# Altium schematic sheet VCC33.SchDoc
size A4; SheetNumber: 4; SheetTotal: 8
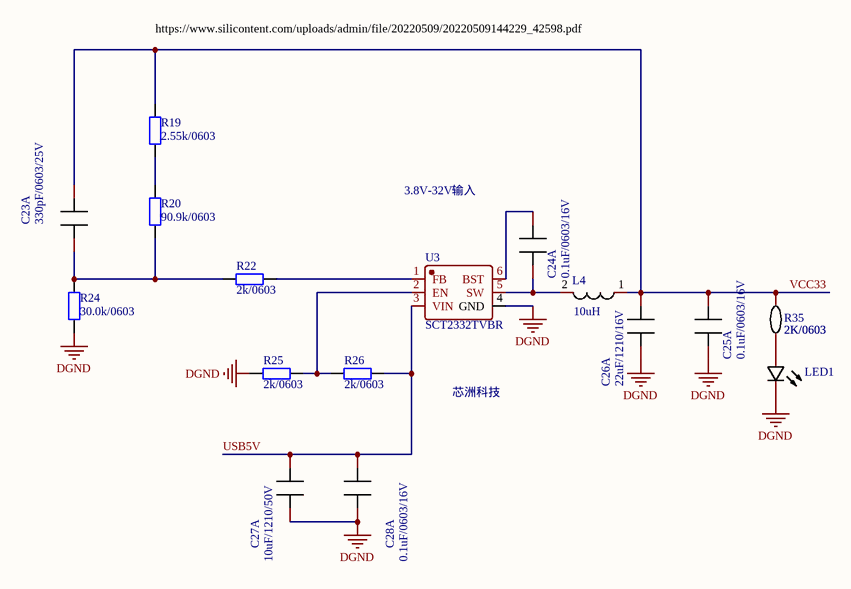
[diagram p0: VCC33.SchDoc]

## Parts
C23  330pF/0603/25V  [CAP0603]  (part A of 4)
C24  0.1uF/0603/16V  [CAP0603]  (part A of 4)
C25  0.1uF/0603/16V  [CAP0603]  (part A of 4)
C26  22uF/1210/16V  [CAP1210-CAPC3225X140N]  (part A of 4)
C27  10uF/1210/50V  [CAP1210-CAPC3225X140N]  (part A of 4)
C28  0.1uF/0603/16V  [CAP0603]  (part A of 4)
L4  10uH  [IND-SMD_L4.7-W4.7-6.5uH]
LED1  19-217/GHC-YR1S2/3T  [LED_0603_KA]  (value not drawn)
R19  2.55k/0603  [RES0603]
R20  90.9k/0603  [RES0603]
R22  2k/0603  [RES0603]
R24  30.0k/0603  [RES0603]
R25  2k/0603  [RES0603]
R26  2k/0603  [RES0603]
R35  2K/0603  [RES0603]
U3  SCT2332TVBR  [SCT2332TVBR-TSOT23-6]

## Nets
DGND: C25.2 C26.2 C27.2 C28.2 LED1.2(C) R24.1 R25.2 U3.4(GND)
USB5V: C27.1 C28.1 R26.1 U3.3(VIN)
VCC33: C23.1 C25.1 C26.1 L4.1 R19.2 R35.1
NetC23_2: C23.2 R20.1 R22.2 R24.2
NetC24_1: C24.1 U3.6(BST)
NetC24_2: C24.2 L4.2 U3.5(SW)
NetLED1_1: LED1.1(A) R35.2
NetR19_1: R19.1 R20.2
NetR22_1: R22.1 U3.1(FB)
NetR25_1: R25.1 R26.2 U3.2(EN)

## Notes on the sheet
- https://www.silicontent.com/uploads/admin/file/20220509/20220509144229_42598.pdf
- 3.8V-32V输入
- 芯洲科技

## Library data of the parts
C23 = CAP0603: SURFACE MOUNT CAPACITOR 0.031 X 0.061 INCHES; Manufacturer #1: IPC SM-782 STD.; Sim_Analog_Order: Model$; PCB DECAL: 0603; Add into BOM: yes; Name: CAP0603; Symbol: CAP0603; Device: CAP0603; OldName: CAP0603; Value: 330pF/0603/25V; Convert to PCB: yes; Origin Footprint: 0603
C24 C25 C28 = CAP0603: SURFACE MOUNT CAPACITOR 0.031 X 0.061 INCHES; Manufacturer #1: IPC SM-782 STD.; Sim_Analog_Order: Model$; Value: 0.1uF/0603/50V; PCB DECAL: 0603; Add into BOM: yes; Name: CAP0603; Symbol: CAP0603; Device: CAP0603; OldName: CAP0603; Convert to PCB: yes; Origin Footprint: 0603
C26 = CAP0603: SURFACE MOUNT CAPACITOR 0.031 X 0.061 INCHES; Manufacturer #1: IPC SM-782 STD.; Sim_Analog_Order: Model$; Value: 22uF/1210/35V; PCB DECAL: 0603; Add into BOM: yes; Name: CAP0603; Symbol: CAP0603; Device: CAP0603; OldName: CAP0603; Convert to PCB: yes; Origin Footprint: 0603
C27 = CAP0603: SURFACE MOUNT CAPACITOR 0.031 X 0.061 INCHES; Manufacturer #1: IPC SM-782 STD.; Sim_Analog_Order: Model$; Value: 10uF/1210/35V; PCB DECAL: 0603; Add into BOM: yes; Name: CAP0603; Symbol: CAP0603; Device: CAP0603; OldName: CAP0603; Convert to PCB: yes; Origin Footprint: 0603
L4 = IND-MOLDED: Sim_Analog_Order: Model$; Sim_Analog_Prefix: L; Description" MOLDED INDUCTOR, 0_5: PIN SPACING; PCB DECAL: L_0650; Add into BOM: yes; Name: IND-MOLDED; Symbol: IND-MOLDED; Device: IND-MOLDED; OldName: IND-MOLDED; Value: 10uH; Convert to PCB: yes; Origin Footprint: L_0650
LED1 = 19-217/GHC-YR1S2/3T: Manufacturer: EVERLIGHT; Convert to PCB: yes; Origin Footprint: LED0603-R-RD; Name: 19-217/GHC-YR1S2/3T; Symbol: 19-217/GHC-YR1S2/3T; Device: 19-217/GHC-YR1S2/3T; Supplier: LCSC; Manufacturer Part: 19-217/GHC-YR1S2/3T; Supplier Part: C72043; JLCPCB Part Class: Basic Part; Add into BOM: yes
R19 R20 R22 R24-R26 = Res2: Resistor; Published: 8-Jun-2000; LatestRevisionDate: 17-Jul-2002; LatestRevisionNote: Re-released for DXP Platform.; PackageReference: AXIAL-0.4; Publisher: Altium Limited; PackageDescription: Axial Device, Thru-Hole; 2 Leads; 0.4 in Pin Spacing
R35 = 2.2K: Manufacturer: UniOhm; Manufacturer Part: 0402WGF2201TCE; Convert to PCB: yes; Origin Footprint: R0402; Name: 2K/0603; Symbol: 2.2K; Device: 2.2K; Supplier: LCSC; Supplier Part: C25879; JLCPCB Part Class: Basic Part; Add into BOM: yes
U3 = SCT2332TVBR: 3.8V-32V Vin, 3A Synchronous Step-down DCDC Converter